# EAGLE design yeasu (EAGLE 6.4)
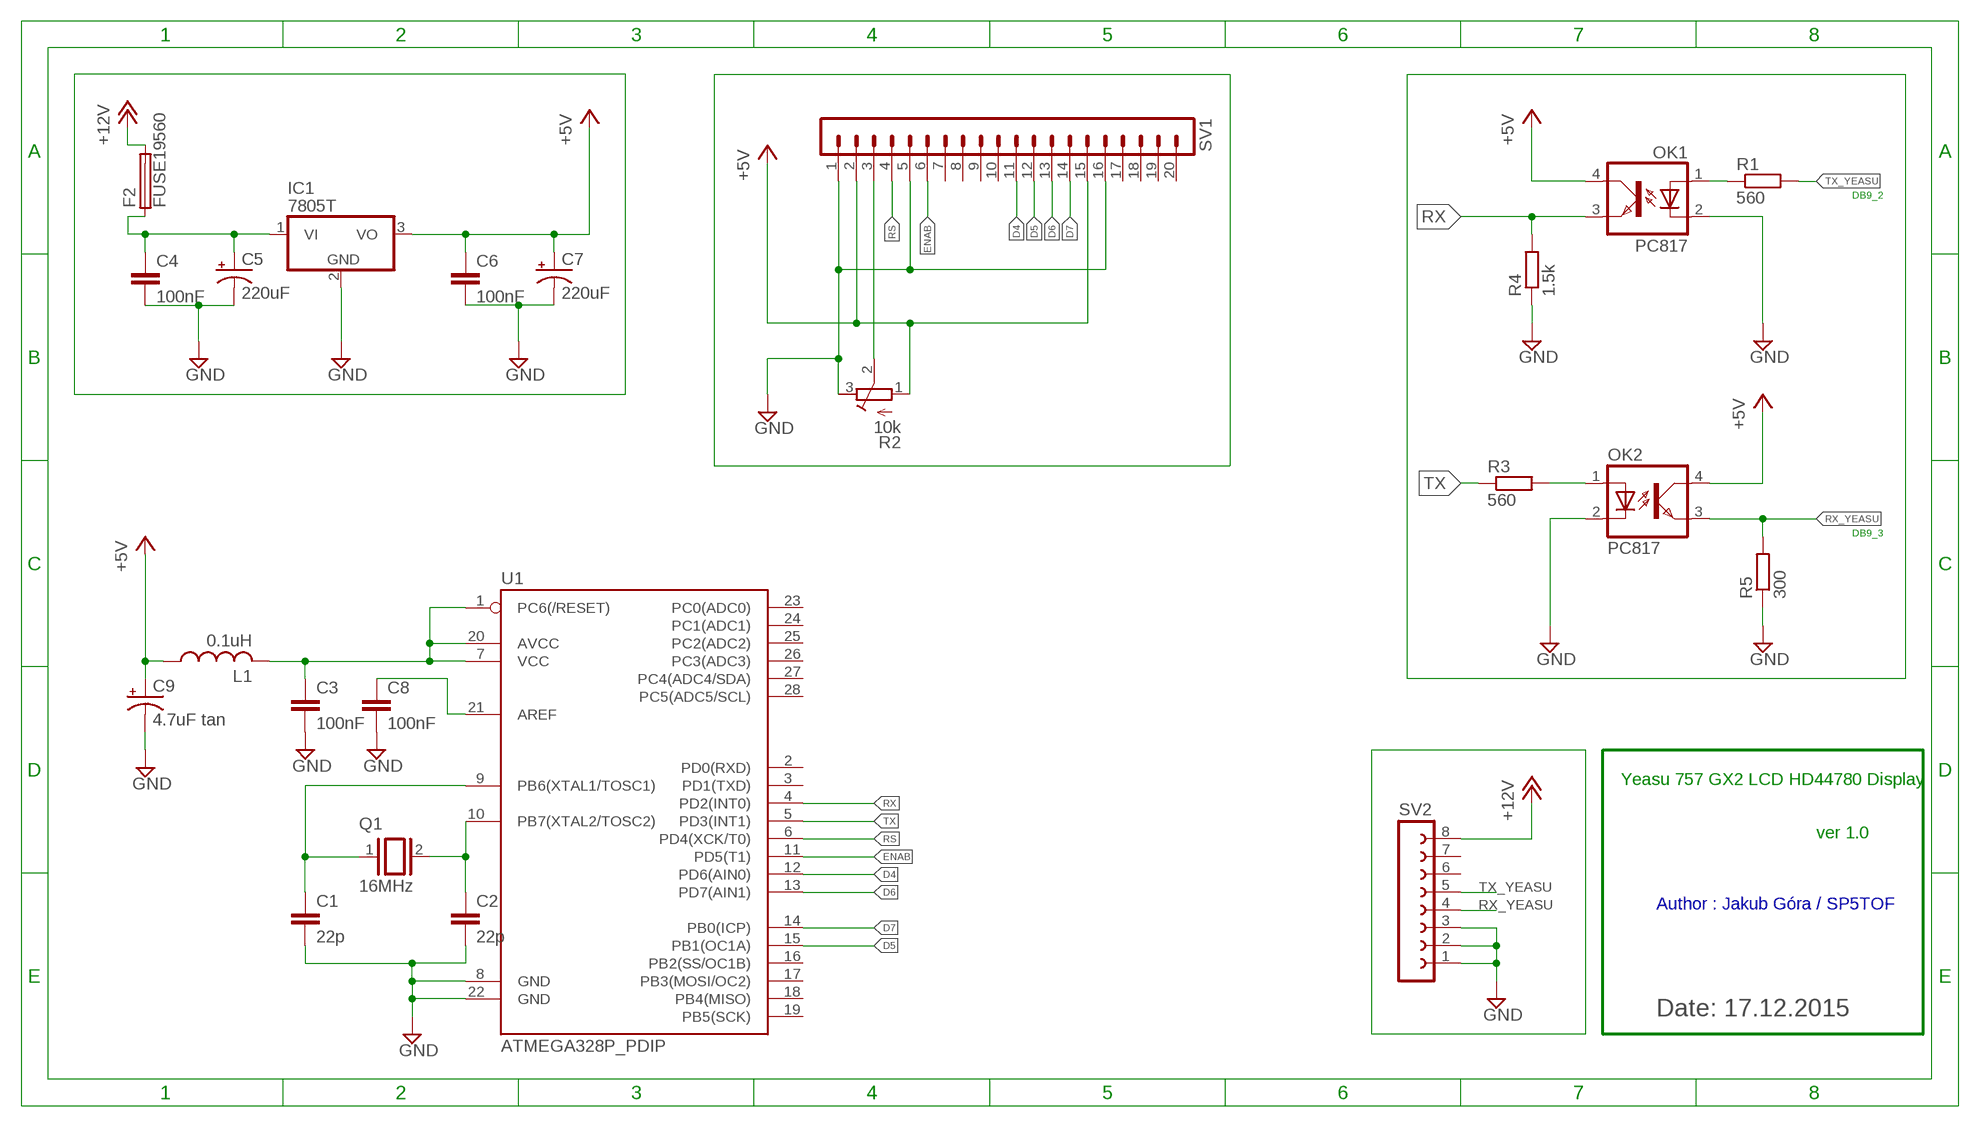
[diagram p0: schematic, sheet 1]

## Parts
C1  22p  C-EU050-024X044  [C050-024X044]
C2  22p  C-EU050-024X044  [C050-024X044]
C3  100nF  C-EU050-024X044  [C050-024X044]
C4  100nF  C-EU050-024X044  [C050-024X044]
C5  220uF  CAP_POLPTH3  [CPOL-RADIAL-1000UF-63V]
C6  100nF  C-EU050-024X044  [C050-024X044]
C7  220uF  CAP_POLPTH3  [CPOL-RADIAL-1000UF-63V]
C8  100nF  C-EU050-024X044  [C050-024X044]
C9  4.7uF tan  CPOL-USE2,5-6E  [E2,5-6E]
F2  FUSE19560  [19560]
IC1  7805T  [TO220H]
L1  0.1uH  L-US0207/7  [0207/7]
OK1  PC817  [DIL04]
OK2  PC817  [DIL04]
Q1  16MHz  XTAL/S  [QS]
R1  560  R-EU_0207/10  [0207/10]
R2  10k  R-TRIMM3339P  [RTRIM3339P]
R3  560  R-EU_0207/10  [0207/10]
R4  1.5k  R-EU_0207/10  [0207/10]
R5  300  R-EU_0207/10  [0207/10]
SV1  MA20-1  [MA20-1]
SV2  FE08-1  [FE08]
U1  ATMEGA328P_PDIP  [DIL28-3]

## Nets
+5V: C6.1 C7.1(+) C9.+ IC1.3(VO) L1.1 OK1.4(COL) OK2.4(COL) R2.1(E) SV1.2 SV1.15
+12V: F2.2 SV2.8
D4: SV1.11 U1.12(PD6(AIN0))
D5: SV1.12 U1.15(PB1(OC1A))
D6: SV1.13 U1.13(PD7(AIN1))
D7: SV1.14 U1.14(PB0(ICP))
ENAB: SV1.6 U1.11(PD5(T1))
GND: C1.2 C2.2 C3.2 C4.2 C5.2(-) C6.2 C7.2(-) C8.2 C9.- IC1.2(GND) OK1.2(C) OK2.2(C) R2.3(A) R4.1 R5.1 SV1.1 SV1.5 SV1.16 SV2.1 SV2.2 SV2.3 U1.8(GND) U1.22(GND)
N$1: OK1.1(A) R1.1
N$2: OK2.1(A) R3.2
N$3: C1.1 Q1.1 U1.9(PB6(XTAL1/TOSC1))
N$4: C2.1 Q1.2 U1.10(PB7(XTAL2/TOSC2))
N$11: C4.1 C5.1(+) F2.1 IC1.1(VI)
N$12: C8.1 U1.21(AREF)
N$13: C3.1 L1.2 U1.1(PC6(/RESET)) U1.7(VCC) U1.20(AVCC)
N$14: R2.2(S) SV1.3
RS: SV1.4 U1.6(PD4(XCK/T0))
RX: OK1.3(EMIT) R4.2 U1.4(PD2(INT0))
RX_YEASU: OK2.3(EMIT) R5.2 SV2.4
TX: R3.1 U1.5(PD3(INT1))
TX_YEASU: R1.2 SV2.5
Unconnected: SV1.7 SV1.8 SV1.9 SV1.10 SV1.17 SV1.18 SV1.19 SV1.20 SV2.6 SV2.7 U1.2(PD0(RXD)) U1.3(PD1(TXD)) U1.16(PB2(SS/OC1B)) U1.17(PB3(MOSI/OC2)) U1.18(PB4(MISO)) U1.19(PB5(SCK)) U1.23(PC0(ADC0)) U1.24(PC1(ADC1)) U1.25(PC2(ADC2)) U1.26(PC3(ADC3)) U1.27(PC4(ADC4/SDA)) U1.28(PC5(ADC5/SCL))

## Notes on the sheet
- DB9_2
- DB9_3
- Yeasu 757 GX2 LCD HD44780 Display
- ver 1.0
- Author : Jakub Góra / SP5TOF
- Date: 17.12.2015

## Library data of the parts
C1-C4 C6 C8 = rcl:C-EU: CAPACITOR, European symbol
C5 C7 = cyberdriver:CAP_POL: Capacitor Polarized These are standard SMD and PTH capacitors. Normally 10uF, 47uF, and 100uF in electrolytic and tantalum varieties. Always verify the external diameter of the through hole cap, it varies with capacity, voltage, and manufacturer. The EIA devices should be standard.
C9 = rcl:CPOL-US: POLARIZED CAPACITOR, American symbol
F2 = fuse:FUSE: Fuse; MPN: 56000001009; OC_FARNELL: 1185363; OC_NEWARK: 98K6125
IC1 = linear:78*: Positive VOLTAGE REGULATOR Source: http://cache.national.com/ds/LM/LM78L05.pdf http://www.fairchildsemi.com/ds/LM/LM7805.pdf
L1 = rcl:L-US: INDUCTOR, American symbol
OK1 OK2 = optocoupler:PC817: SHARP OPTO COUPLER; MPN: PC817X4J000F; OC_FARNELL: 9707727; OC_NEWARK: 97K7059
Q1 = special:XTAL/S: CRYSTAL
R1 R3-R5 = rcl:R-EU_: RESISTOR, European symbol
R2 = resistor:R-TRIMM: Trimm resistor
SV1 = con-lstb:MA20-1: PIN HEADER; OC_FARNELL: unknown; OC_NEWARK: unknown
SV2 = con-lsta:FE08-1: FEMALE HEADER; OC_FARNELL: unknown; OC_NEWARK: unknown
U1 = SparkFun-DigitalIC:ATMEGA328P_PDIP: uC used in the Arduino 32kb flash, 1k EEPROM, 2k SRAM This is the through-hole version of this chip.

## Board
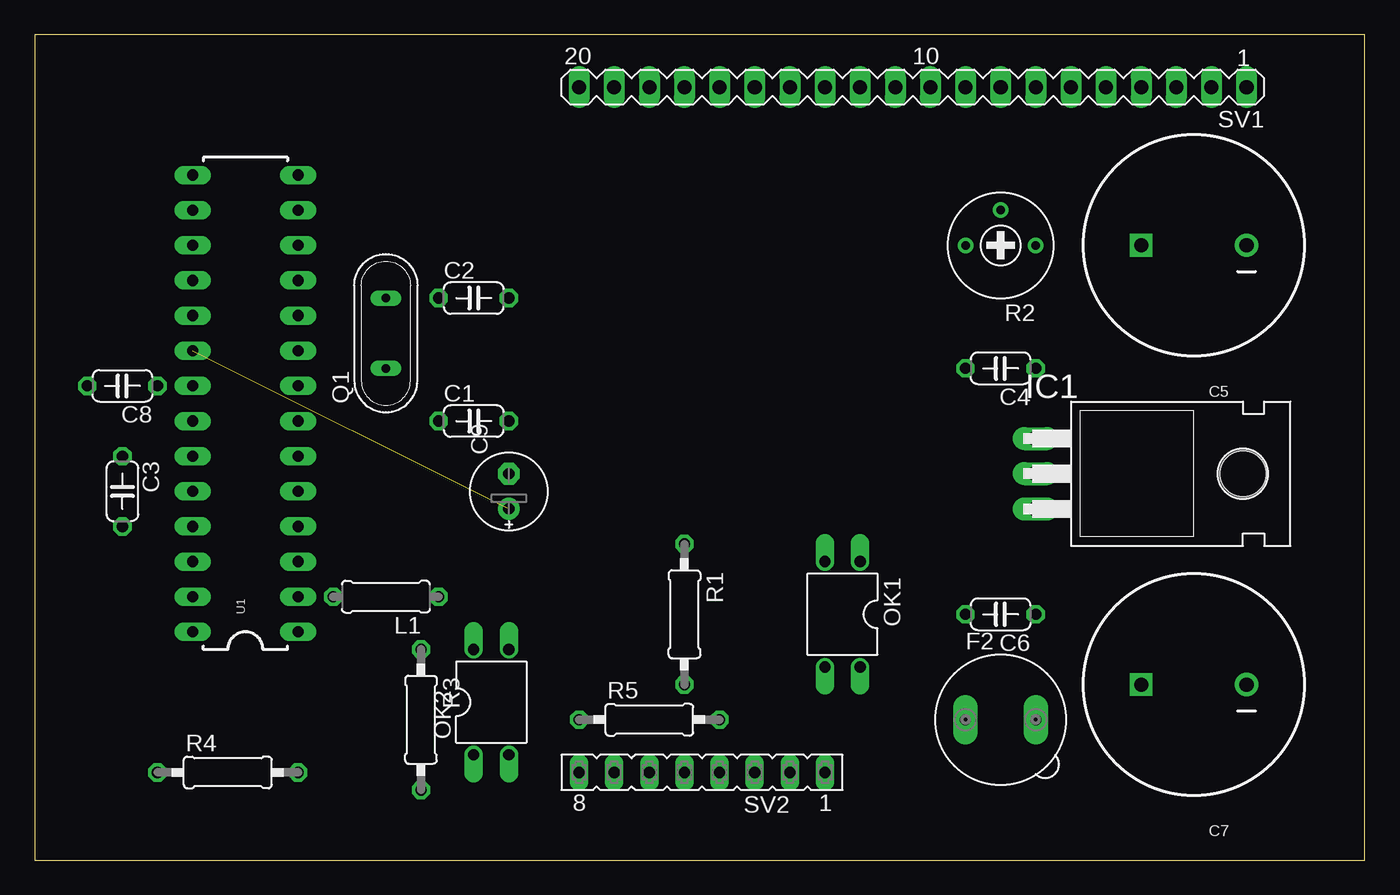
[diagram p1: board, top side]
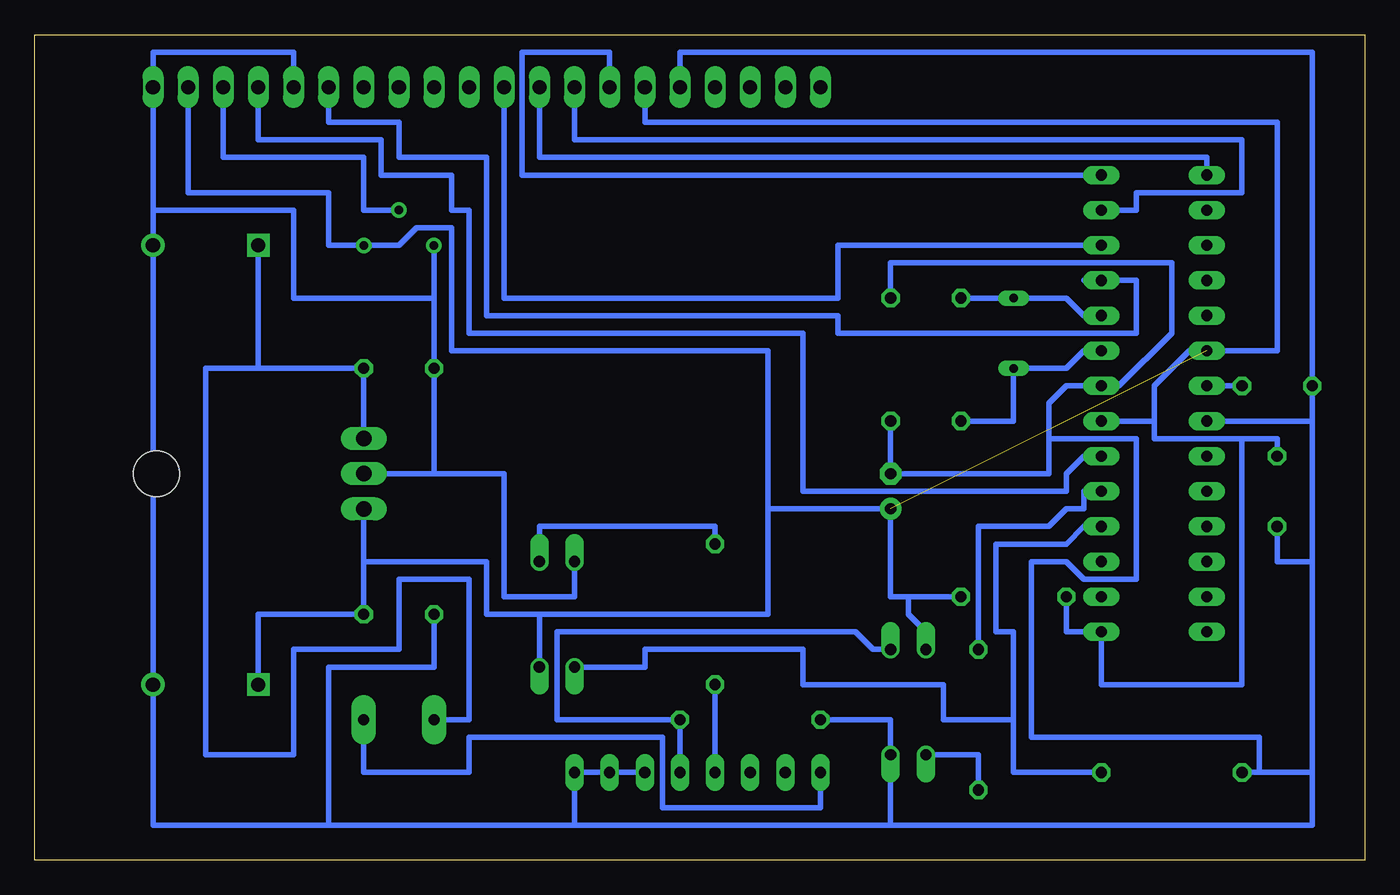
[diagram p2: board, bottom side, seen from below]

Size 96.19 x 59.68 mm. Coordinates in mm from the lower left corner, seen from the top.
Outline: 0,0 96.19,0 96.19,59.68 0,59.68 0,0
Copper layers (1*16): Top 0.035mm / dielectric 1.5mm / Bottom 0.035mm
Design rules "default": minimum track width 10mil, minimum drill 24mil, track to track 8mil, track to pad 8mil, pad to pad 8mil, via to via 8mil, smd to smd 8mil, copper to edge 40mil, drill to drill 8mil, minimum pad ring 10mil, minimum via ring 8mil, stop-mask expansion 4mil, vias tented up to drill 0mil, thermal gap 10mil

### Footprints (pad centres in the part's own frame; a part is rotated, then mirrored left to right if it is on the bottom)
C050-024X044 = drill 0.813 octagon: 1 -2.54,0; 2 2.54,0
CPOL-RADIAL-1000UF-63V = drill 1.016 pad 1.651 square: 1 3.81,0 | drill 1.016 pad 1.676: 2 -3.81,0
E2,5-6E = drill 0.813 pad 1.575: + -1.27,0 | drill 0.813 pad 1.575 octagon: - 1.27,0
19560 = drill 0.813 pad 1.778 long: 1 -2.54,0; 2 2.54,0
TO220H = drill 1.118 long: 1 -2.54,-10.16; 2 0,-10.16; 3 2.54,-10.16 | hole 3.302: 0,4.826
0207/7 = drill 0.813 octagon: 1 -3.81,0; 2 3.81,0
DIL04 = drill 0.813 offset: 1 -1.27,-3.81; 2 1.27,-3.81; 3 1.27,3.81; 4 -1.27,3.81
QS = drill 0.61 long: 1 -2.54,0; 2 2.54,0
0207/10 = drill 0.813 octagon: 1 -5.08,0; 2 5.08,0
RTRIM3339P = drill 0.61: 1 -2.54,0; 2 0,-2.54; 3 2.54,0
MA20-1 = drill 1.016 long: 1 -24.13,0; 2 -21.59,0; 3 -19.05,0; 4 -16.51,0; 5 -13.97,0; 6 -11.43,0; 7 -8.89,0; 8 -6.35,0; 9 -3.81,0; 10 -1.27,0; 11 1.27,0; 12 3.81,0; 13 6.35,0; 14 8.89,0; 15 11.43,0; 16 13.97,0; 17 16.51,0; 18 19.05,0; 19 21.59,0; 20 24.13,0
FE08 = drill 0.813 long: 1 -8.89,0; 2 -6.35,0; 3 -3.81,0; 4 -1.27,0; 5 1.27,0; 6 3.81,0; 7 6.35,0; 8 8.89,0
DIL28-3 = drill 0.813 long: 1 -16.51,-3.81; 2 -13.97,-3.81; 3 -11.43,-3.81; 4 -8.89,-3.81; 5 -6.35,-3.81; 6 -3.81,-3.81; 7 -1.27,-3.81; 8 1.27,-3.81; 9 3.81,-3.81; 10 6.35,-3.81; 11 8.89,-3.81; 12 11.43,-3.81; 13 13.97,-3.81; 14 16.51,-3.81; 15 16.51,3.81; 16 13.97,3.81; 17 11.43,3.81; 18 8.89,3.81; 19 6.35,3.81; 20 3.81,3.81; 21 1.27,3.81; 22 -1.27,3.81; 23 -3.81,3.81; 24 -6.35,3.81; 25 -8.89,3.81; 26 -11.43,3.81; 27 -13.97,3.81; 28 -16.51,3.81

### Placement (x,y rotation side)
C1  31.75,31.75 0 top
C2  31.75,40.64 0 top
C3  6.35,26.67 270 top
C4  69.85,35.56 180 top
C5  83.82,44.45 180 top
C6  69.85,17.78 180 top
C7  83.82,12.7 180 top
C8  6.35,34.29 180 top
C9  34.29,26.67 90 top
F2  69.85,10.16 0 top
IC1  82.55,27.94 270 top
L1  25.4,19.05 180 top
OK1  58.42,17.78 180 top
OK2  33.02,11.43 0 top
Q1  25.4,38.1 90 top
R1  46.99,17.78 270 top
R2  69.85,44.45 180 top
R3  27.94,10.16 270 top
R4  13.97,6.35 0 top
R5  44.45,10.16 0 top
SV1  63.5,55.88 180 top
SV2  48.26,6.35 180 top
U1  15.24,33.02 90 top

### Tracks (layer width: path | path; a pad name or v marks a point on that pad's centre or on a via)
+5V  (1 unrouted)
  Bottom 0.406: C7.1 80.01,17.78 C6.1 72.39,21.59 | 72.39,21.59 IC1.3 | SV1.2 85.09,48.26 74.93,48.26 74.93,44.45 R2.1 69.85,44.45 68.58,45.72 66.04,45.72 66.04,36.83 43.18,36.83 43.18,25.4 | L1.1 33.02,19.05 | 33.02,19.05 34.29,19.05 C9.+ 43.18,25.4 | 43.18,25.4 43.18,17.78 59.69,17.78 | 72.39,21.59 63.5,21.59 63.5,17.78 59.69,17.78 | OK1.4 59.69,17.78 | OK2.4 31.75,16.51 33.02,17.78 33.02,19.05 | SV1.15 52.07,53.34 6.35,53.34 6.35,36.83 11.43,36.83
+12V
  Bottom 0.406: F2.2 72.39,6.35 64.77,6.35 64.77,8.89 50.8,8.89 50.8,3.81 39.37,3.81 SV2.8
D4
  Bottom 0.406: SV1.11 62.23,40.64 38.1,40.64 38.1,44.45 U1.12
D5
  Bottom 0.406: SV1.12 59.69,50.8 11.43,50.8 U1.15
D6
  Bottom 0.406: SV1.13 57.15,52.07 8.89,52.07 8.89,48.26 16.51,48.26 16.51,46.99 U1.13
D7
  Bottom 0.406: SV1.14 54.61,58.42 60.96,58.42 60.96,49.53 U1.14
ENAB
  Bottom 0.406: SV1.6 74.93,53.34 69.85,53.34 69.85,50.8 63.5,50.8 63.5,39.37 38.1,39.37 38.1,38.1 16.51,38.1 16.51,41.91 U1.11 20.32,41.91
GND
  Bottom 0.406: 57.15,2.54 SV2.1 SV2.2 SV2.3 | 57.15,2.54 74.93,2.54 | 74.93,2.54 87.63,2.54 C7.2 C5.2 87.63,46.99 | 87.63,46.99 SV1.1 87.63,58.42 77.47,58.42 SV1.5 | 3.81,31.75 C8.2 3.81,58.42 49.53,58.42 SV1.16 | 3.81,31.75 3.81,21.59 | 3.81,21.59 3.81,6.35 | 3.81,6.35 3.81,2.54 34.29,2.54 | 34.29,2.54 57.15,2.54 | C6.2 67.31,13.97 74.93,13.97 74.93,2.54 | R2.3 C4.2 | U1.22 3.81,31.75 | C2.2 34.29,43.18 13.97,43.18 13.97,38.1 17.78,34.29 U1.8 21.59,34.29 22.86,33.02 22.86,30.48 | OK1.2 57.15,19.05 62.23,19.05 62.23,27.94 IC1.2 67.31,27.94 C4.2 | R4.1 7.62,6.35 | 7.62,6.35 3.81,6.35 | 34.29,2.54 OK2.2 34.29,10.16 R5.1 | C4.2 67.31,40.64 77.47,40.64 77.47,46.99 87.63,46.99 | C3.2 6.35,21.59 3.81,21.59 | 22.86,30.48 16.51,30.48 16.51,20.32 20.32,20.32 21.59,21.59 24.13,21.59 24.13,8.89 7.62,8.89 7.62,6.35 | C1.2 C9.- 22.86,27.94 22.86,30.48
N$1
  Bottom 0.406: OK1.1 59.69,24.13 46.99,24.13 R1.1
N$2
  Bottom 0.406: OK2.1 27.94,7.62 R3.2
N$3
  Bottom 0.406: U1.9 20.32,36.83 21.59,35.56 Q1.1 25.4,31.75 C1.1
N$4
  Bottom 0.406: U1.10 20.32,39.37 21.59,40.64 Q1.2 C2.1
N$11
  Bottom 0.406: C5.1 80.01,35.56 | 80.01,35.56 C4.1 IC1.1 | F2.1 64.77,10.16 64.77,20.32 69.85,20.32 69.85,15.24 77.47,15.24 77.47,7.62 83.82,7.62 83.82,35.56 80.01,35.56
N$12
  Bottom 0.406: C8.1 U1.21
N$13
  Bottom 0.406: U1.7 15.24,31.75 | U1.20 12.7,36.83 15.24,34.29 15.24,31.75 | C3.1 6.35,30.48 8.89,30.48 | 8.89,30.48 15.24,30.48 15.24,31.75 | 8.89,30.48 8.89,12.7 19.05,12.7 U1.1 21.59,16.51 L1.2
N$14
  Bottom 0.406: R2.2 72.39,46.99 72.39,50.8 82.55,50.8 SV1.3
RS
  Bottom 0.406: SV1.4 80.01,52.07 71.12,52.07 71.12,49.53 66.04,49.53 66.04,46.99 64.77,46.99 64.77,38.1 40.64,38.1 40.64,26.67 21.59,26.67 21.59,27.94 20.32,29.21 U1.6
RX
  Bottom 0.406: U1.4 20.32,24.13 21.59,22.86 26.67,22.86 26.67,16.51 25.4,16.51 25.4,10.16 | OK1.3 52.07,13.97 52.07,15.24 40.64,15.24 40.64,12.7 30.48,12.7 30.48,10.16 25.4,10.16 | R4.2 25.4,6.35 25.4,10.16
RX_YEASU
  Bottom 0.406: SV2.4 R5.2 58.42,10.16 58.42,16.51 36.83,16.51 35.56,15.24 OK2.3
TX
  Bottom 0.406: U1.5 20.32,26.67 20.32,25.4 21.59,25.4 22.86,24.13 27.94,24.13 R3.1
TX_YEASU
  Bottom 0.406: SV2.5 R1.2